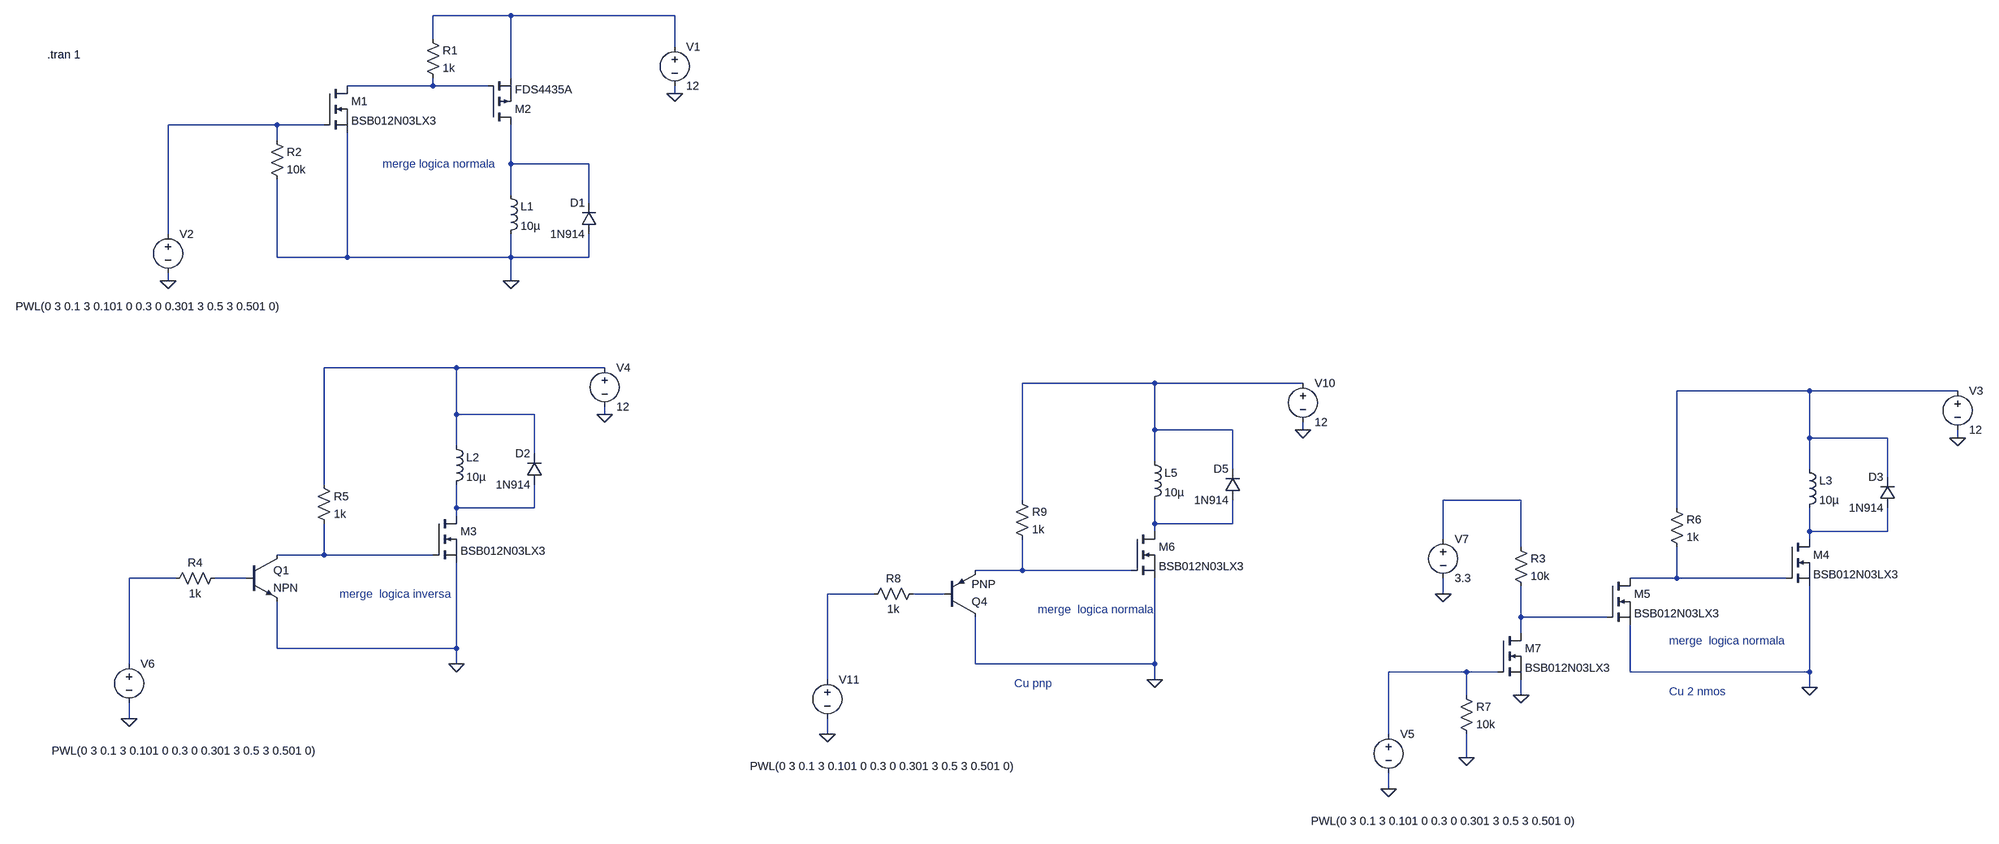
[diagram p0: schematic solenoid_driver.asc]
solenoid_driver.asc, the LTspice schematic file:
Version 4
SHEET 1 4792 1748
WIRE 1680 -1072 1520 -1072
WIRE 2016 -1072 1680 -1072
WIRE 1520 -1024 1520 -1072
WIRE 2016 -1008 2016 -1072
WIRE 1680 -944 1680 -1072
WIRE 1520 -928 1520 -944
WIRE 1520 -928 1344 -928
WIRE 1632 -928 1520 -928
WIRE 2016 -912 2016 -928
WIRE 1200 -848 976 -848
WIRE 1296 -848 1200 -848
WIRE 1200 -816 1200 -848
WIRE 1680 -768 1680 -848
WIRE 1840 -768 1680 -768
WIRE 1680 -704 1680 -768
WIRE 1840 -688 1840 -768
WIRE 976 -624 976 -848
WIRE 1200 -576 1200 -736
WIRE 1344 -576 1344 -832
WIRE 1344 -576 1200 -576
WIRE 1680 -576 1680 -624
WIRE 1680 -576 1344 -576
WIRE 1840 -576 1840 -624
WIRE 1840 -576 1680 -576
WIRE 976 -528 976 -544
WIRE 1680 -528 1680 -576
WIRE 1568 -48 1296 -48
WIRE 1872 -48 1568 -48
WIRE 3088 -16 2816 -16
WIRE 3392 -16 3088 -16
WIRE 4432 0 4160 0
WIRE 4736 0 4432 0
WIRE 1568 48 1568 -48
WIRE 1728 48 1568 48
WIRE 1872 48 1872 32
WIRE 3088 80 3088 -16
WIRE 3248 80 3088 80
WIRE 3392 80 3392 64
WIRE 4432 96 4432 0
WIRE 4592 96 4432 96
WIRE 4736 96 4736 80
WIRE 1568 112 1568 48
WIRE 1728 128 1728 48
WIRE 3088 144 3088 80
WIRE 3248 160 3248 80
WIRE 4432 160 4432 96
WIRE 4592 176 4592 96
WIRE 1296 192 1296 -48
WIRE 2816 224 2816 -16
WIRE 3840 224 3680 224
WIRE 1568 240 1568 192
WIRE 1728 240 1728 192
WIRE 1728 240 1568 240
WIRE 4160 240 4160 0
WIRE 1568 256 1568 240
WIRE 3088 272 3088 224
WIRE 3248 272 3248 224
WIRE 3248 272 3088 272
WIRE 3088 288 3088 272
WIRE 4432 288 4432 240
WIRE 4592 288 4592 240
WIRE 4592 288 4432 288
WIRE 3680 304 3680 224
WIRE 4432 304 4432 288
WIRE 3840 320 3840 224
WIRE 1296 336 1296 272
WIRE 1296 336 1200 336
WIRE 1520 336 1296 336
WIRE 2816 368 2816 304
WIRE 2816 368 2720 368
WIRE 3040 368 2816 368
WIRE 992 384 896 384
WIRE 1136 384 1072 384
WIRE 4160 384 4160 320
WIRE 4160 384 4064 384
WIRE 4384 384 4160 384
WIRE 2512 416 2416 416
WIRE 2656 416 2592 416
WIRE 3680 416 3680 384
WIRE 3840 464 3840 400
WIRE 4016 464 3840 464
WIRE 3840 496 3840 464
WIRE 1200 528 1200 432
WIRE 1568 528 1568 352
WIRE 1568 528 1200 528
WIRE 896 560 896 384
WIRE 1568 560 1568 528
WIRE 2720 560 2720 464
WIRE 3088 560 3088 384
WIRE 3088 560 2720 560
WIRE 3728 576 3568 576
WIRE 3792 576 3728 576
WIRE 4064 576 4064 480
WIRE 4432 576 4432 400
WIRE 4432 576 4064 576
WIRE 2416 592 2416 416
WIRE 3088 592 3088 560
WIRE 4432 608 4432 576
WIRE 3728 624 3728 576
WIRE 3840 624 3840 592
WIRE 896 672 896 640
WIRE 2416 704 2416 672
WIRE 3568 704 3568 576
WIRE 3728 752 3728 704
WIRE 3568 816 3568 784
FLAG 1568 560 0
FLAG 1872 48 0
FLAG 896 672 0
FLAG 1680 -528 0
FLAG 2016 -912 0
FLAG 976 -528 0
FLAG 3088 592 0
FLAG 3392 80 0
FLAG 2416 704 0
FLAG 4432 608 0
FLAG 4736 96 0
FLAG 3568 816 0
FLAG 3840 624 0
FLAG 3728 752 0
FLAG 3680 416 0
SYMBOL ind 1552 96 R0
SYMATTR InstName L2
SYMATTR Value 10µ
SYMATTR SpiceLine Rser=10
SYMBOL nmos 1520 256 R0
SYMATTR InstName M3
SYMATTR Value BSB012N03LX3
SYMBOL voltage 1872 -64 R0
WINDOW 123 0 0 Left 0
WINDOW 39 0 0 Left 0
SYMATTR InstName V4
SYMATTR Value 12
SYMBOL voltage 896 544 R0
WINDOW 3 -159 194 Left 2
WINDOW 123 0 0 Left 0
WINDOW 39 0 0 Left 0
SYMATTR Value PWL(0 3 0.1 3 0.101 0 0.3 0 0.301 3 0.5 3 0.501 0)
SYMATTR InstName V6
SYMBOL diode 1744 192 R180
WINDOW 0 24 64 Left 2
WINDOW 3 24 0 Left 2
SYMATTR InstName D2
SYMATTR Value 1N914
SYMBOL npn 1136 336 R0
SYMATTR InstName Q1
SYMBOL res 976 400 R270
WINDOW 0 32 56 VTop 2
WINDOW 3 0 56 VBottom 2
SYMATTR InstName R4
SYMATTR Value 1k
SYMBOL res 1280 176 R0
SYMATTR InstName R5
SYMATTR Value 1k
SYMBOL ind 1664 -720 R0
SYMATTR InstName L1
SYMATTR Value 10µ
SYMATTR SpiceLine Rser=10
SYMBOL nmos 1296 -928 R0
SYMATTR InstName M1
SYMATTR Value BSB012N03LX3
SYMBOL voltage 2016 -1024 R0
WINDOW 123 0 0 Left 0
WINDOW 39 0 0 Left 0
SYMATTR InstName V1
SYMATTR Value 12
SYMBOL voltage 976 -640 R0
WINDOW 3 -313 165 Left 2
WINDOW 123 0 0 Left 0
WINDOW 39 0 0 Left 0
SYMATTR Value PWL(0 3 0.1 3 0.101 0 0.3 0 0.301 3 0.5 3 0.501 0)
SYMATTR InstName V2
SYMBOL diode 1856 -624 R180
WINDOW 0 24 64 Left 2
WINDOW 3 24 0 Left 2
SYMATTR InstName D1
SYMATTR Value 1N914
SYMBOL pmos 1632 -848 M180
SYMATTR InstName M2
SYMATTR Value FDS4435A
SYMBOL res 1504 -1040 R0
SYMATTR InstName R1
SYMATTR Value 1k
SYMBOL res 1184 -832 R0
SYMATTR InstName R2
SYMATTR Value 10k
SYMBOL ind 3072 128 R0
SYMATTR InstName L5
SYMATTR Value 10µ
SYMATTR SpiceLine Rser=10
SYMBOL nmos 3040 288 R0
SYMATTR InstName M6
SYMATTR Value BSB012N03LX3
SYMBOL voltage 3392 -32 R0
WINDOW 123 0 0 Left 0
WINDOW 39 0 0 Left 0
SYMATTR InstName V10
SYMATTR Value 12
SYMBOL voltage 2416 576 R0
WINDOW 3 -159 194 Left 2
WINDOW 123 0 0 Left 0
WINDOW 39 0 0 Left 0
SYMATTR Value PWL(0 3 0.1 3 0.101 0 0.3 0 0.301 3 0.5 3 0.501 0)
SYMATTR InstName V11
SYMBOL diode 3264 224 R180
WINDOW 0 24 64 Left 2
WINDOW 3 24 0 Left 2
SYMATTR InstName D5
SYMATTR Value 1N914
SYMBOL res 2496 432 R270
WINDOW 0 32 56 VTop 2
WINDOW 3 0 56 VBottom 2
SYMATTR InstName R8
SYMATTR Value 1k
SYMBOL res 2800 208 R0
SYMATTR InstName R9
SYMATTR Value 1k
SYMBOL pnp 2656 464 M180
SYMATTR InstName Q4
SYMBOL ind 4416 144 R0
SYMATTR InstName L3
SYMATTR Value 10µ
SYMATTR SpiceLine Rser=10
SYMBOL nmos 4384 304 R0
SYMATTR InstName M4
SYMATTR Value BSB012N03LX3
SYMBOL voltage 4736 -16 R0
WINDOW 123 0 0 Left 0
WINDOW 39 0 0 Left 0
SYMATTR InstName V3
SYMATTR Value 12
SYMBOL voltage 3568 688 R0
WINDOW 3 -159 194 Left 2
WINDOW 123 0 0 Left 0
WINDOW 39 0 0 Left 0
SYMATTR Value PWL(0 3 0.1 3 0.101 0 0.3 0 0.301 3 0.5 3 0.501 0)
SYMATTR InstName V5
SYMBOL diode 4608 240 R180
WINDOW 0 24 64 Left 2
WINDOW 3 24 0 Left 2
SYMATTR InstName D3
SYMATTR Value 1N914
SYMBOL res 4144 224 R0
SYMATTR InstName R6
SYMATTR Value 1k
SYMBOL nmos 4016 384 R0
SYMATTR InstName M5
SYMATTR Value BSB012N03LX3
SYMBOL nmos 3792 496 R0
SYMATTR InstName M7
SYMATTR Value BSB012N03LX3
SYMBOL res 3824 304 R0
SYMATTR InstName R3
SYMATTR Value 10k
SYMBOL res 3712 608 R0
SYMATTR InstName R7
SYMATTR Value 10k
SYMBOL voltage 3680 288 R0
WINDOW 123 0 0 Left 0
WINDOW 39 0 0 Left 0
SYMATTR InstName V7
SYMATTR Value 3.3
TEXT 728 -992 Left 2 !.tran 1
TEXT 1328 416 Left 2 ;merge  logica inversa
TEXT 1416 -768 Left 2 ;merge logica normala
TEXT 2848 448 Left 2 ;merge  logica normala
TEXT 2800 600 Left 2 ;Cu pnp
TEXT 4144 512 Left 2 ;merge  logica normala
TEXT 4144 616 Left 2 ;Cu 2 nmos

The netlist it stands for:
* solenoid_driver.asc
L2 N005 N009 10µ Rser=10
M3 N009 N012 0 0 BSB012N03LX3
V4 N005 0 12
V6 N014 0 PWL(0 3 0.1 3 0.101 0 0.3 0 0.301 3 0.5 3 0.501 0)
D2 N009 N005 1N914
Q1 N012 N015 0 0 NPN
R4 N014 N015 1k
R5 N005 N012 1k
L1 N004 0 10µ Rser=10
M1 N002 N003 0 0 BSB012N03LX3
V1 N001 0 12
V2 N003 0 PWL(0 3 0.1 3 0.101 0 0.3 0 0.301 3 0.5 3 0.501 0)
D1 0 N004 1N914
M2 N004 N002 N001 N001 FDS4435A
R1 N001 N002 1k
R2 N003 0 10k
L5 N006 N010 10µ Rser=10
M6 N010 N013 0 0 BSB012N03LX3
V10 N006 0 12
V11 N017 0 PWL(0 3 0.1 3 0.101 0 0.3 0 0.301 3 0.5 3 0.501 0)
D5 N010 N006 1N914
R8 N017 N018 1k
R9 N006 N013 1k
Q4 0 N018 N013 0 PNP
L3 N007 N011 10µ Rser=10
M4 N011 N016 0 0 BSB012N03LX3
V3 N007 0 12
V5 N020 0 PWL(0 3 0.1 3 0.101 0 0.3 0 0.301 3 0.5 3 0.501 0)
D3 N011 N007 1N914
R6 N007 N016 1k
M5 N016 N019 0 0 BSB012N03LX3
M7 N019 N020 0 0 BSB012N03LX3
R3 N008 N019 10k
R7 N020 0 10k
V7 N008 0 3.3
.model D D
.lib standard.dio
.model NPN NPN
.model PNP PNP
.lib standard.bjt
.model NMOS NMOS
.model PMOS PMOS
.lib standard.mos
.tran 1
* merge  logica inversa
* merge logica normala
* merge  logica normala
* Cu pnp
* merge  logica normala
* Cu 2 nmos
.backanno
.end